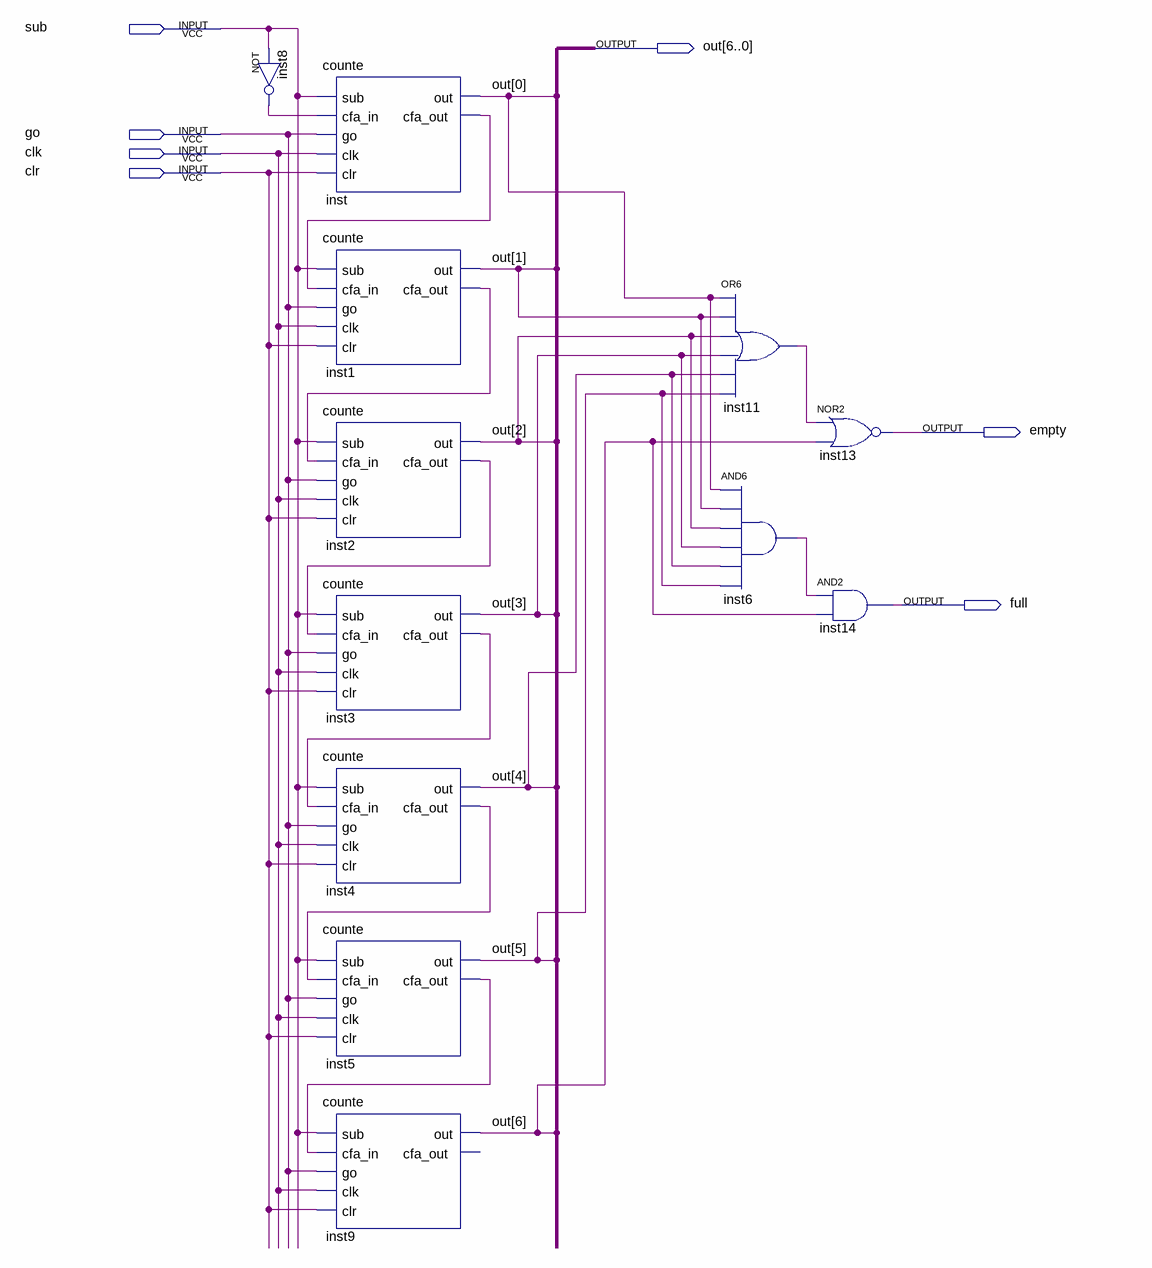
[diagram p0: schematic sheet]
// Quartus schematic count.bdf as structural Verilog: 12 symbols, 7 pins
module count (
  input  sub,
  input  go,
  input  clk,
  input  clr,
  output [6:0] out,
  output empty,
  output full
);

  wire inst1_cfa_out, inst2_cfa_out, inst3_cfa_out, inst4_cfa_out, inst5_cfa_out, inst6_out, inst8_out,
       inst11_out, inst_cfa_out;

  not inst8 (inst8_out, sub);
  counte inst (.sub(sub), .cfa_in(inst8_out), .go(go), .clk(clk), .clr(clr), .out(out[0]), .cfa_out(inst_cfa_out));
  counte inst1 (.sub(sub), .cfa_in(inst_cfa_out), .go(go), .clk(clk), .clr(clr), .out(out[1]), .cfa_out(inst1_cfa_out));
  counte inst2 (
    .sub(sub), .cfa_in(inst1_cfa_out), .go(go), .clk(clk), .clr(clr), .out(out[2]), .cfa_out(inst2_cfa_out));
  counte inst3 (
    .sub(sub), .cfa_in(inst2_cfa_out), .go(go), .clk(clk), .clr(clr), .out(out[3]), .cfa_out(inst3_cfa_out));
  counte inst4 (
    .sub(sub), .cfa_in(inst3_cfa_out), .go(go), .clk(clk), .clr(clr), .out(out[4]), .cfa_out(inst4_cfa_out));
  counte inst5 (
    .sub(sub), .cfa_in(inst4_cfa_out), .go(go), .clk(clk), .clr(clr), .out(out[5]), .cfa_out(inst5_cfa_out));
  counte inst9 (.sub(sub), .cfa_in(inst5_cfa_out), .go(go), .clk(clk), .clr(clr), .out(out[6]));  // open: cfa_out
  or inst11 (inst11_out, out[0], out[1], out[2], out[3], out[4], out[5]);
  and inst6 (inst6_out, out[0], out[1], out[2], out[3], out[4], out[5]);
  nor inst13 (empty, inst11_out, out[6]);
  and inst14 (full, inst6_out, out[6]);
endmodule
